# Altium schematic sheet RF.SchDoc
size A4
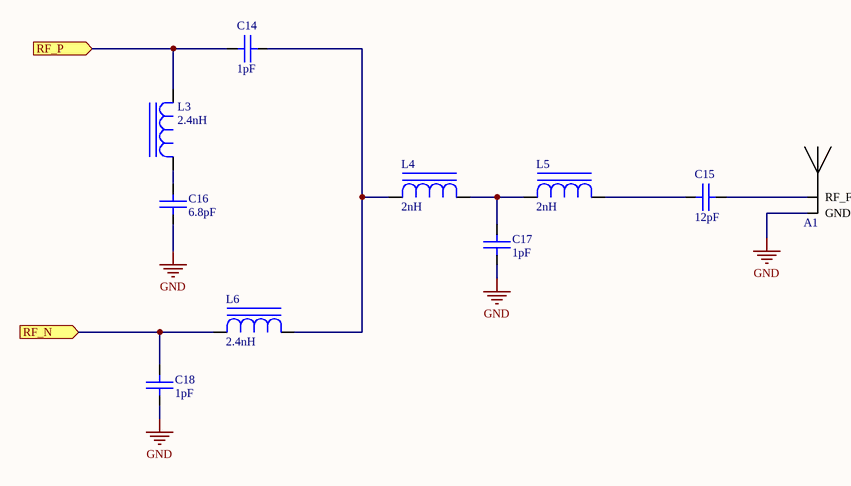
[diagram p0: RF.SchDoc]

## Parts
A1  Antenna Wi-Fi  [Antenna_WiFi]  (value not drawn)
C14  1pF  [CC0402]
C15  12pF  [CC0402]
C16  6.8pF  [CC0402]
C17  1pF  [CC0402]
C18  1pF  [CC0402]
L3  2.4nH  [L0402]
L4  2nH  [L0402]
L5  2nH  [L0402]
L6  2.4nH  [L0402]

## Ports
RF_N (in), RF_P (in)

## Nets
GND: A1.2(GND) C16.1(A) C17.1(A) C18.1(A)
RF_N: C18.2(B) L6.1(A) ; port RF_N
RF_P: C14.2(B) L3.2(C) ; port RF_P
NetA1_1: A1.1(RF_Feed) C15.2(B)
NetC14_1: C14.1(A) L4.1(A) L6.2(C)
NetC15_1: C15.1(A) L5.2(C)
NetC16_2: C16.2(B) L3.1(A)
NetC17_2: C17.2(B) L4.2(C) L5.1(A)

## Library data of the parts
A1 = Antenna Wi-Fi: 2.43GHz
C14-C18 = CC0402
  C14 C17 C18: Value: 1pF
  C15: Value: 12pF
  C16: Value: 6.8pF
L3-L6 = L0402
  L3 L6: Value: 2.4nH
  L4 L5: Value: 2nH